# EasyEDA schematic 线路连接_立创EDA源码.json
TITLE: 基于树莓派墨水屏智能终端设计线路连接示意图; REV: 1.0; Date: 2021-01-17; Sheet: 1/1; Drawn By: Yellow-feces; Company: N/A
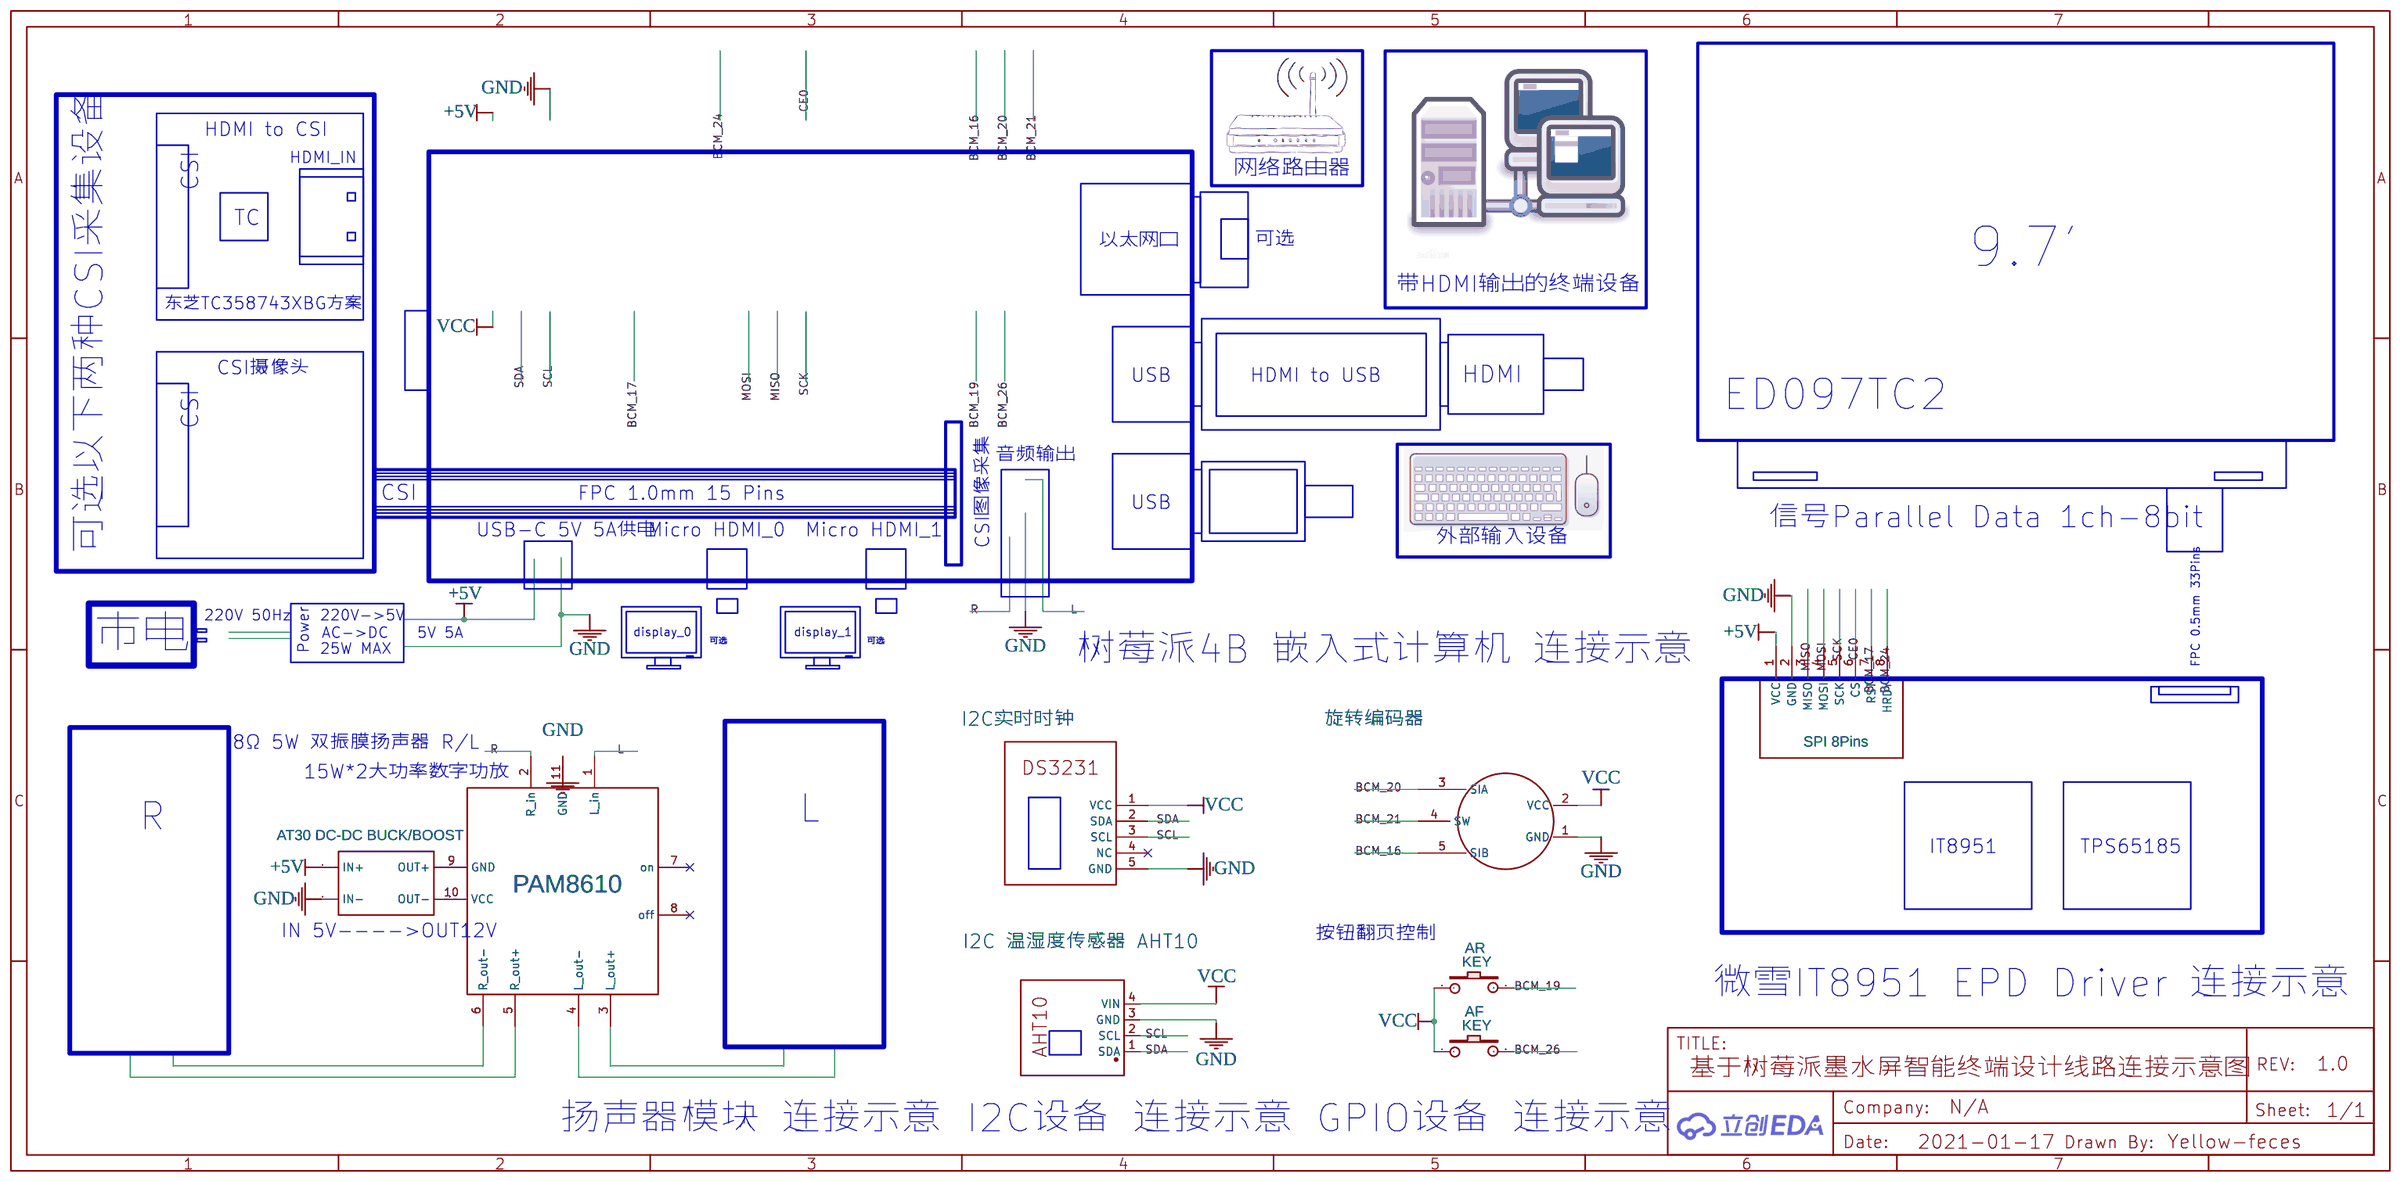
[diagram p0: schematic sheet]

## Parts
AF  KEY  [AN12]
AR  KEY  [AN12]
J1  SPI 8Pins  [8PIN]
SW1  旋转编码器  [SW_EC11]
U2  PAM8610  [PAM8610模块（贴片）]
U3  AT30 DC-DC BUCK/BOOST  [AT30]
U4  I2C实时时钟  [DS3231]
U5  I2C 温湿度传感器 AHT10  [AHT10]

## Library data of the parts
AF AR = KEY: Contributor: yiyi
J1 = 8pin SPI 1.77: Contributor: dsinjok
SW1 = 旋转编码器: Contributor: voodooli
U2 = PAM8610_Module: Manufacturer Part: New SchematicLib; Contributor: Kowalski
U3 = AT30: Supplier Part: undefined; link: https://item.taobao.com/item.htm?spm=a1z09.2.0.0.35322e8dFttwKE&id=534519672033&_u=e1r15nnve590; Contributor: z656565
U4 = DS3231: link: Small Formfactor For Raspberry PI; Contributor: Skulk
U5 = AHT10: Contributor: BOY-next-door

## Nets
+5V: J1.1(VCC)
GND: J1.2(GND) SW1.1(GND) U4.5(GND) U5.3(GND)
VCC: AF.1 AR.1 SW1.2(VCC) U4.1(VCC) U5.4(VIN)
BCM_16: SW1.5(SIB)
BCM_17: J1.7(RST)
BCM_19: AR.2
BCM_20: SW1.3(SIA)
BCM_21: SW1.4(SW)
BCM_24: J1.8(HRDY)
BCM_26: AF.2
CE0: J1.6(CS)
L: U2.1(L_in)
MISO: J1.3(MISO)
MOSI: J1.4(MOSI)
R: U2.2(R_in)
SCK: J1.5(SCK)
SCL: U4.3(SCL) U5.2(SCL)
SDA: U4.2(SDA) U5.1(SDA)

Not connected (* = marked no-connect by the designer): U2 3(L_out+) 4(L_out-) 5(R_out+) 6(R_out-) 7(on)* 8(off)* 9(GND) 10(VCC) 11(GND); U3 1(IN+) 2(IN-) 3(OUT-) 4(OUT+); U4 4(NC)*

## Notes on the sheet
- HDMI to CSI
- HDMI_IN
- 网络路由器
- CSI
- TC
- 9.7'
- 以太网口
- 可选
- 带HDMI输出的终端设备
- 东芝TC358743XBG方案
- CSI摄像头
- USB
- HDMI to USB
- HDMI
- ED097TC2
- CSI
- 音频输出
- CSI
- FPC 1.0mm 15 Pins
- USB
- 信号Parallel Data 1ch-8bit
- USB-C 5V 5A供电
- Micro HDMI_0
- Micro HDMI_1
- 外部输入设备
- 可选以下两种CSI采集设备
- CSI图像采集
- 市电
- 220V 50Hz
- 220V->5V
- AC->DC
- 5V 5A
- display_0
- 可选
- display_1
- 可选
- 树莓派4B 嵌入式计算机 连接示意
- Power
- 25W MAX
- FPC 0.5mm 33Pins
- 8Ω 5W 双振膜扬声器 R/L
- 15W*2大功率数字功放
- R
- L
- IT8951
- TPS65185
- IN 5V---->OUT12V
- 按钮翻页控制
- 微雪IT8951 EPD Driver 连接示意
- 扬声器模块 连接示意
- I2C设备 连接示意
- GPIO设备 连接示意
